# EAGLE design turnstile swing (EAGLE 9.6.2)
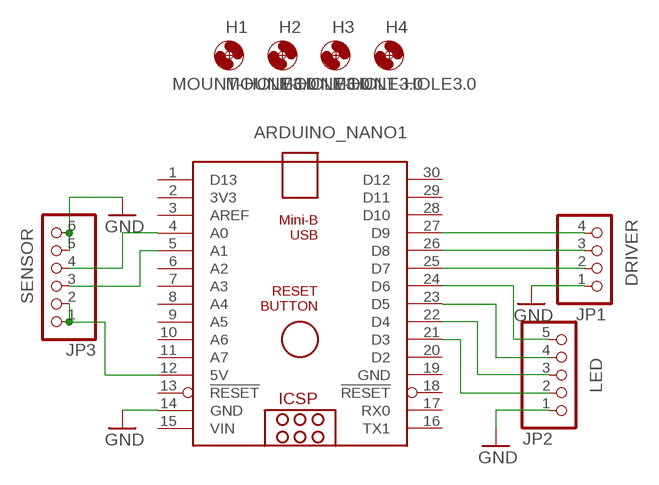
[diagram p0: schematic, sheet 1]

## Parts
ARDUINO_NANO1  ARDUINO_NANO  [ARDUINO_NANO]
H1  MOUNT-HOLE3.0  [3,0]
H2  MOUNT-HOLE3.0  [3,0]
H3  MOUNT-HOLE3.0  [3,0]
H4  MOUNT-HOLE3.0  [3,0]
JP1  PINHD-1X4  [1X04]
JP2  PINHD-1X5  [1X05]
JP3  PINHD-1X6  [1X06]

## Nets
GND: ARDUINO_NANO1.14(GND) JP1.1 JP2.1 JP3.5 JP3.6
N$1: ARDUINO_NANO1.12(5V) JP3.1 JP3.2
N$2: ARDUINO_NANO1.5(A1) JP3.3
N$3: ARDUINO_NANO1.4(A0) JP3.4
N$4: ARDUINO_NANO1.25(D7) JP1.2
N$5: ARDUINO_NANO1.26(D8) JP1.3
N$6: ARDUINO_NANO1.27(D9) JP1.4
N$7: ARDUINO_NANO1.21(D3) JP2.2
N$8: ARDUINO_NANO1.22(D4) JP2.3
N$9: ARDUINO_NANO1.23(D5) JP2.4
N$10: ARDUINO_NANO1.24(D6) JP2.5
Unconnected: ARDUINO_NANO1.1(D13) ARDUINO_NANO1.2(3V3) ARDUINO_NANO1.3(AREF) ARDUINO_NANO1.6(A2) ARDUINO_NANO1.7(A3) ARDUINO_NANO1.8(A4) ARDUINO_NANO1.9(A5) ARDUINO_NANO1.10(A6) ARDUINO_NANO1.11(A7) ARDUINO_NANO1.13(!RESET) ARDUINO_NANO1.16(TX1) ARDUINO_NANO1.17(RX0) ARDUINO_NANO1.18(!RESET) ARDUINO_NANO1.20(D2) ARDUINO_NANO1.28(D10) ARDUINO_NANO1.29(D11) ARDUINO_NANO1.30(D12)

## Notes on the sheet
- DRIVER
- SENSOR
- LED

## Power pins joined to a net without a drawn wire
GND: ARDUINO_NANO1.19(GND)
VIN: ARDUINO_NANO1.15(VIN)

## Library data of the parts
ARDUINO_NANO1 = ArduinoNanoV30:ARDUINO_NANO: Arduino Nano V3.0 Overview: The Arduino Nano is a small, complete, and breadboard-friendly board based on the ATmega328 (Arduino Nano 3.x) or ATmega168 (Arduino Nano 2.x). It has more or less the same functionality of the Arduino Duemilanove, but in a different package. It lacks only a DC power jack, and works with a Mini-B USB cable instead of a standard one. The Nano was designed and is being produced by Gravitech. Specifications: Microcontroller Atmel ATmega168 or ATmega328 Operating Voltage (logic level) 5 V Input Voltage (recommended) 7-12 V Input Voltage (limits) 6-20 V Digital I/O Pins 14 (of which 6 provide PWM output) Analog Input Pins 8 DC Current per I/O Pin 40 mA Flash Memory 16 KB (ATmega168) or 32 KB (ATmega328) of which 2 KB used by bootloader SRAM 1 KB (ATmega168) or 2 KB (ATmega328) EEPROM 512 bytes (ATmega168) or 1 KB (ATmega328) Clock Speed 16 MHz Dimensions 0.73" x 1.70" Length 45 mm Width 18 mm Weigth 5 g Power: The Arduino Nano can be powered via the Mini-B USB connection, 6-20V unregulated external power supply (pin 30), or 5V regulated external power supply (pin 27). The power source is automatically selected to the highest voltage source. Memory: The ATmega168 has 16 KB of flash memory for storing code (of which 2 KB is used for the bootloader); the ATmega328 has 32 KB, (also with 2 KB used for the bootloader). The ATmega168 has 1 KB of SRAM and 512 bytes of EEPROM (which can be read and written with the EEPROM library); the ATmega328 has 2 KB of SRAM and 1 KB of EEPROM. Input and Output: Each of the 14 digital pins on the Nano can be used as an input or output, using pinMode(), digitalWrite(), and digitalRead() functions. They operate at 5 volts. Each pin can provide or receive a maximum of 40 mA and has an internal pull-up resistor (disconnected by default) of 20-50 kOhms. In addition, some pins have specialized functions. Visit Arduino - ArduinoBoardNano <https://www.arduino.cc/en/Main/ArduinoBoardNano>
H1-H4 = holes:MOUNT-HOLE: MOUNTING HOLE with drill center marker
JP1 = pinhead:PINHD-1X4: PIN HEADER
JP2 = pinhead:PINHD-1X5: PIN HEADER
JP3 = pinhead:PINHD-1X6: PIN HEADER

## Board
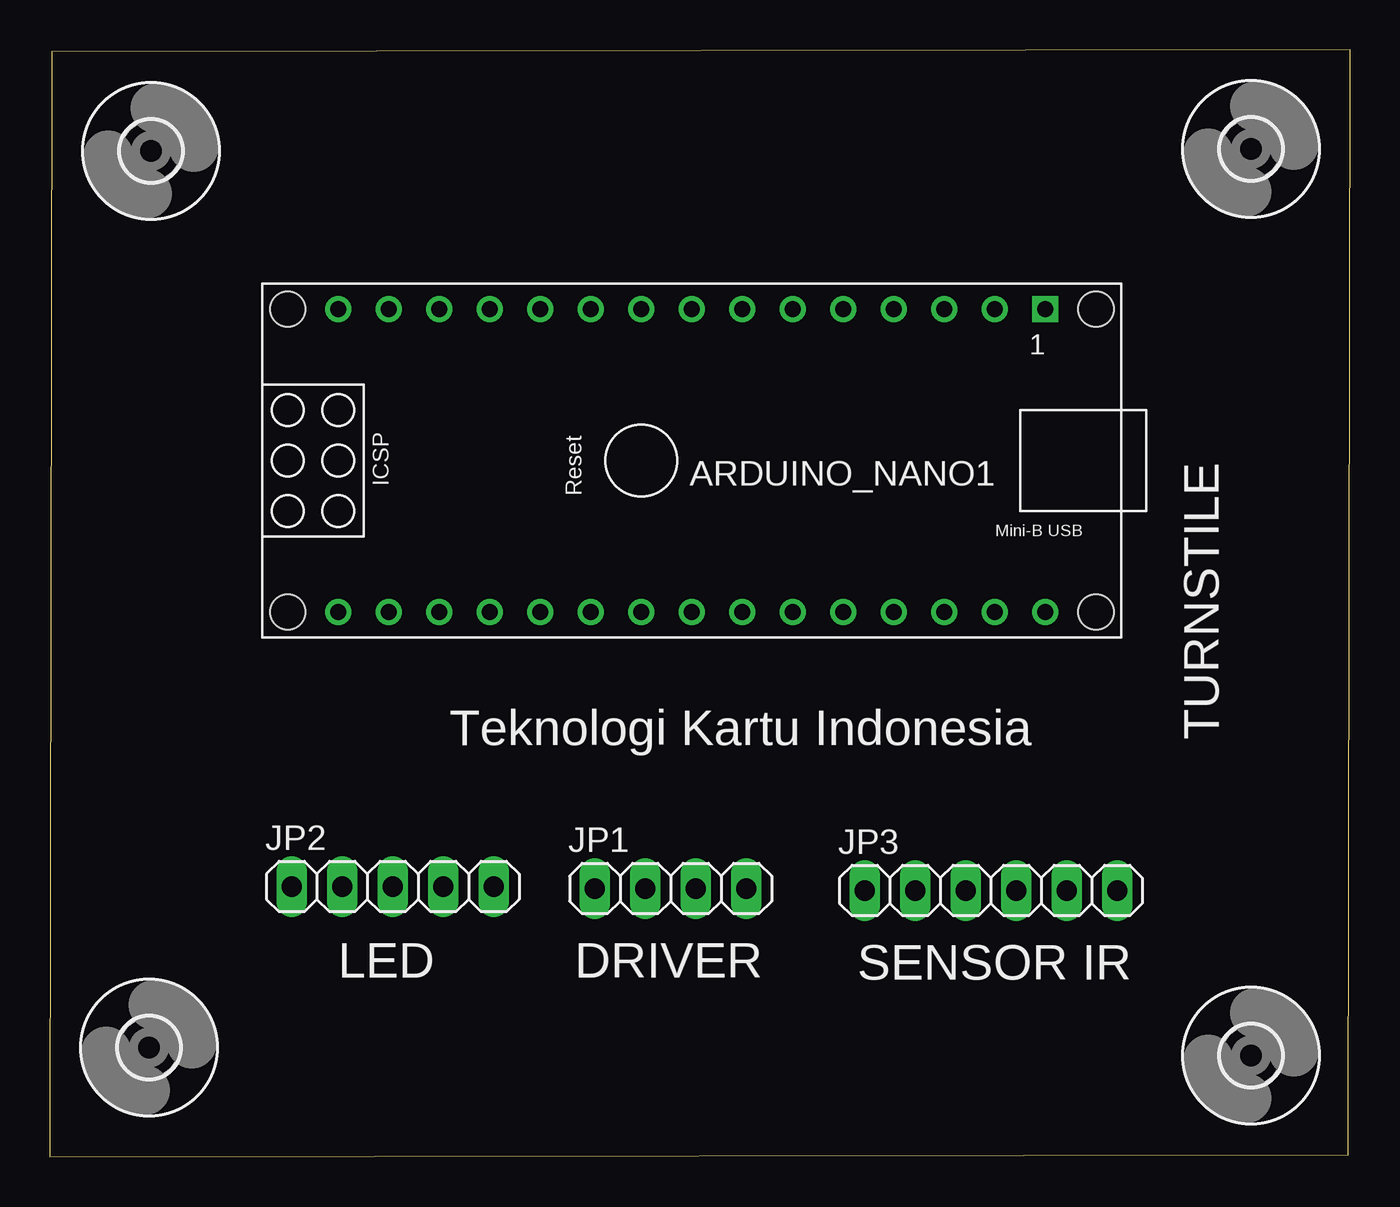
[diagram p1: board, top side]
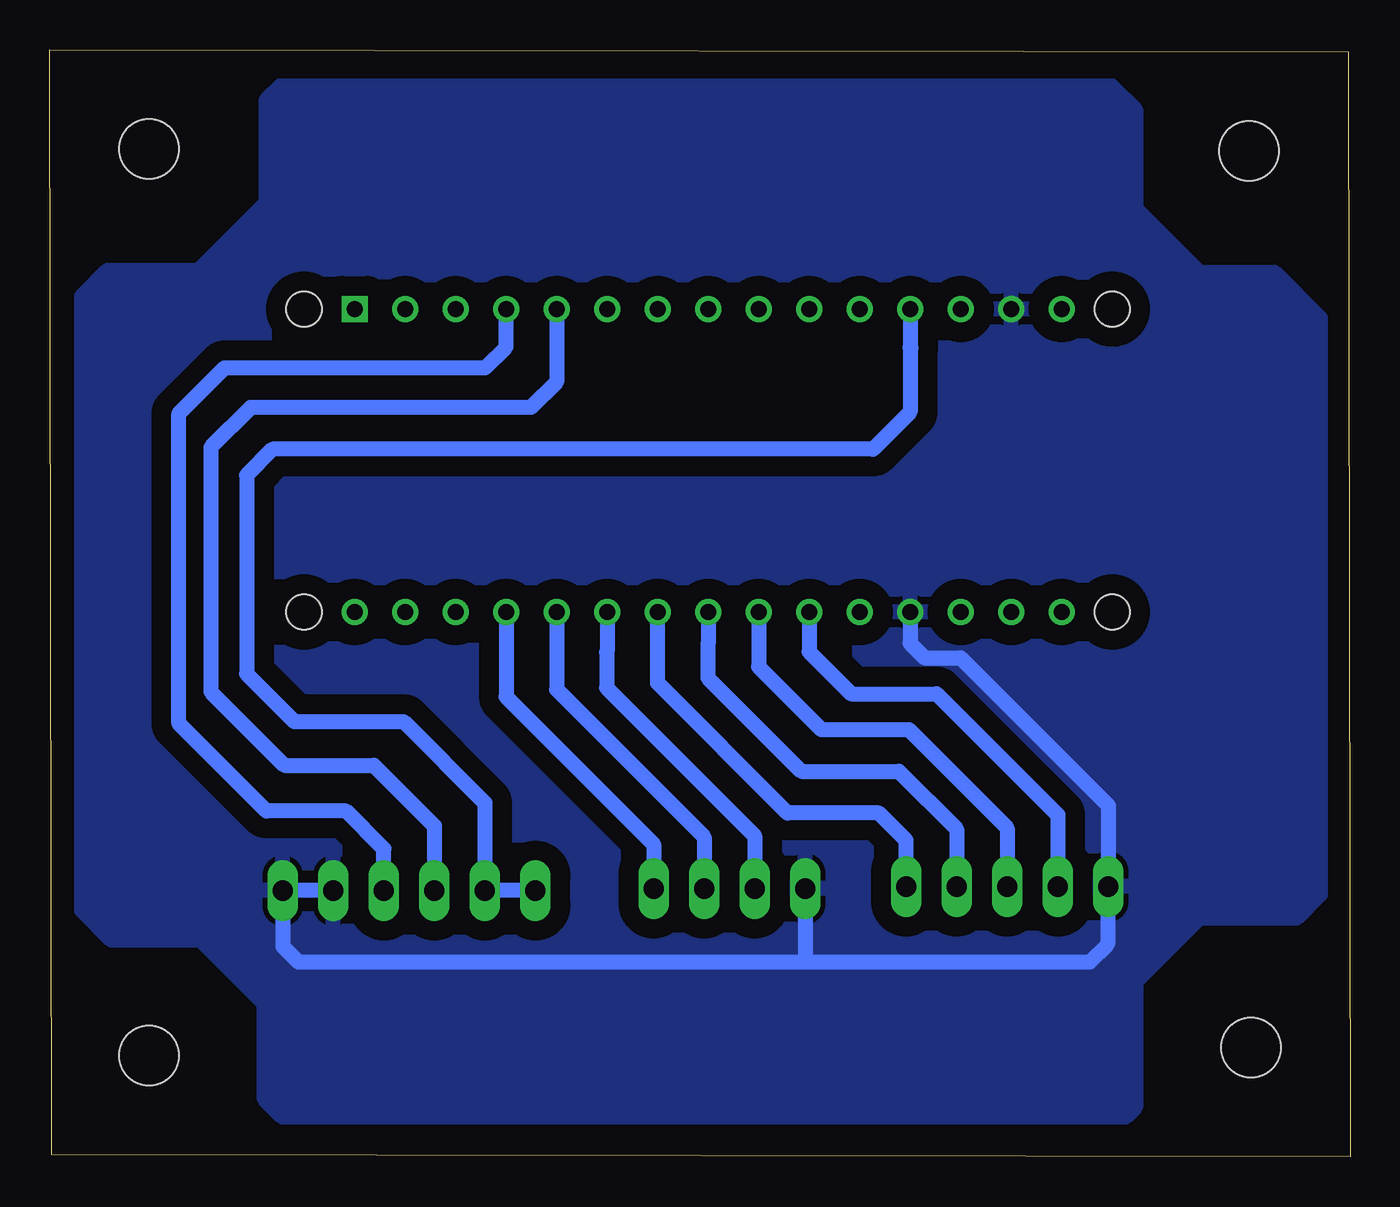
[diagram p2: board, bottom side, seen from below]

Size 65.4 x 55.7 mm. Coordinates in mm from the lower left corner, seen from the top.
Outline: 0,0 65.3,0.1 65.4,55.7 0.1,55.6 0,0
Copper layers (1*16): Top 0.035mm / dielectric 1.5mm / Bottom 0.035mm
Design rules "default": minimum track width 6mil, minimum drill 0.35mm, track to track 12mil, track to pad 12mil, pad to pad 12mil, via to via 6mil, smd to smd 12mil, copper to edge 24mil, drill to drill 6mil, minimum pad ring 10mil, minimum via ring 8mil, stop-mask expansion 4mil, vias tented up to drill 0mil, thermal gap 10mil

### Footprints (pad centres in the part's own frame; a part is rotated, then mirrored left to right if it is on the bottom)
ARDUINO_NANO = drill 0.8 square: 1 -20.32,-7.62 | drill 0.8: 2 -17.78,-7.62; 3 -15.24,-7.62; 4 -12.7,-7.62; 5 -10.16,-7.62; 6 -7.62,-7.62; 7 -5.08,-7.62; 8 -2.54,-7.62; 9 0,-7.62; 10 2.54,-7.62; 11 5.08,-7.62; 12 7.62,-7.62; 13 10.16,-7.62; 14 12.7,-7.62; 15 15.24,-7.62; 16 15.24,7.62; 17 12.7,7.62; 18 10.16,7.62; 19 7.62,7.62; 20 5.08,7.62; 21 2.54,7.62; 22 0,7.62; 23 -2.54,7.62; 24 -5.08,7.62; 25 -7.62,7.62; 26 -10.16,7.62; 27 -12.7,7.62; 28 -15.24,7.62; 29 -17.78,7.62; 30 -20.32,7.62 | hole 1.778: -22.86,-7.62; -22.86,7.62; 17.78,7.62; 17.78,-7.62
3,0 = hole 3: 0,0
1X04 = drill 1.016 long: 1 -3.81,0; 2 -1.27,0; 3 1.27,0; 4 3.81,0
1X05 = drill 1.016 long: 1 -5.08,0; 2 -2.54,0; 3 0,0; 4 2.54,0; 5 5.08,0
1X06 = drill 1.016 long: 1 -6.35,0; 2 -3.81,0; 3 -1.27,0; 4 1.27,0; 5 3.81,0; 6 6.35,0

### Placement (x,y rotation side)
ARDUINO_NANO1  29.75,35.03 180 top
H1  5.1,50.6 180 top
H2  60.4,50.7 0 top
H3  5,5.5 0 top
H4  60.4,5.1 0 top
JP1  31.22,13.5 0 top
JP2  17.25,13.6 0 top
JP3  47.33,13.4 0 top

### Tracks (layer width: path | path; a pad name or v marks a point on that pad's centre or on a via)
GND
  Bottom 0.75: ARDUINO_NANO1.19 22.13,25.83 21.4,25.1 19.6,25.1 12.17,17.67 JP2.1 12.2,13.57 12.2,10.7 13.1,9.8 27.3,9.8 | JP3.5 JP3.6 53.68,10.58 52.9,9.8 27.3,9.8 | JP1.1 27.41,9.91 27.3,9.8
  pour Bottom (isolate 1): 1.5,13.2 2.7,12 7.6,12 10.8,8.8 10.8,2.5 11.3,2 53.7,2 54.6,2.9 54.6,7.7 57.8,10.9 62.3,10.9 63.8,12.4 63.8,43.3 62.5,44.6 57.9,44.6 54.5,48 54.5,53.2 53.8,53.9 12,53.9 10.8,52.7 10.8,47.7 7.6,44.5 3.8,44.5 1.5,42.2
N$1
  Bottom 0.75: JP3.1 JP3.2 43.52,17.82 47.6,21.9 53.1,21.9 55.5,24.3 55.5,34.3 54.2,35.6 24,35.6 22.13,37.47 22.13,40.73 | ARDUINO_NANO1.12 22.13,40.73 | 22.13,40.73 22.1,40.7
N$2
  Bottom 0.75: ARDUINO_NANO1.5 39.91,38.99 41.2,37.7 55.3,37.7 57.3,35.7 57.3,23.4 53.6,19.7 49.1,19.7 46.06,16.66 JP3.3
N$3
  Bottom 0.75: JP3.4 48.6,15.5 50.5,17.4 54.5,17.4 58.9,21.8 58.9,37.4 56.6,39.7 43.5,39.7 42.45,40.75 ARDUINO_NANO1.4
N$4
  Bottom 0.75: ARDUINO_NANO1.25 37.37,25.43 37.4,25.4 37.4,23.6 29.95,16.15 JP1.2
N$5
  Bottom 0.75: ARDUINO_NANO1.26 39.91,23.51 32.49,16.09 JP1.3
N$6
  Bottom 0.75: ARDUINO_NANO1.27 42.45,23.15 35.03,15.73 JP1.4
N$7
  Bottom 0.75: ARDUINO_NANO1.21 27.21,25.41 25.1,23.3 20.8,23.3 14.71,17.21 JP2.2
N$8
  Bottom 0.75: ARDUINO_NANO1.22 29.75,24.65 26.6,21.5 22.2,21.5 17.25,16.55 JP2.3
N$9
  Bottom 0.75: ARDUINO_NANO1.23 32.29,25.81 32.3,25.8 32.3,24.1 27.6,19.4 22.7,19.4 19.79,16.49 JP2.4
N$10
  Bottom 0.75: JP2.5 22.33,15.93 23.7,17.3 28.3,17.3 34.83,23.83 ARDUINO_NANO1.24

### Text on the board
tNames: Teknologi Kartu Indonesia | TURNSTILE | LED | DRIVER | SENSOR IR